# EAGLE design lcd_new (EAGLE 8.1.1)
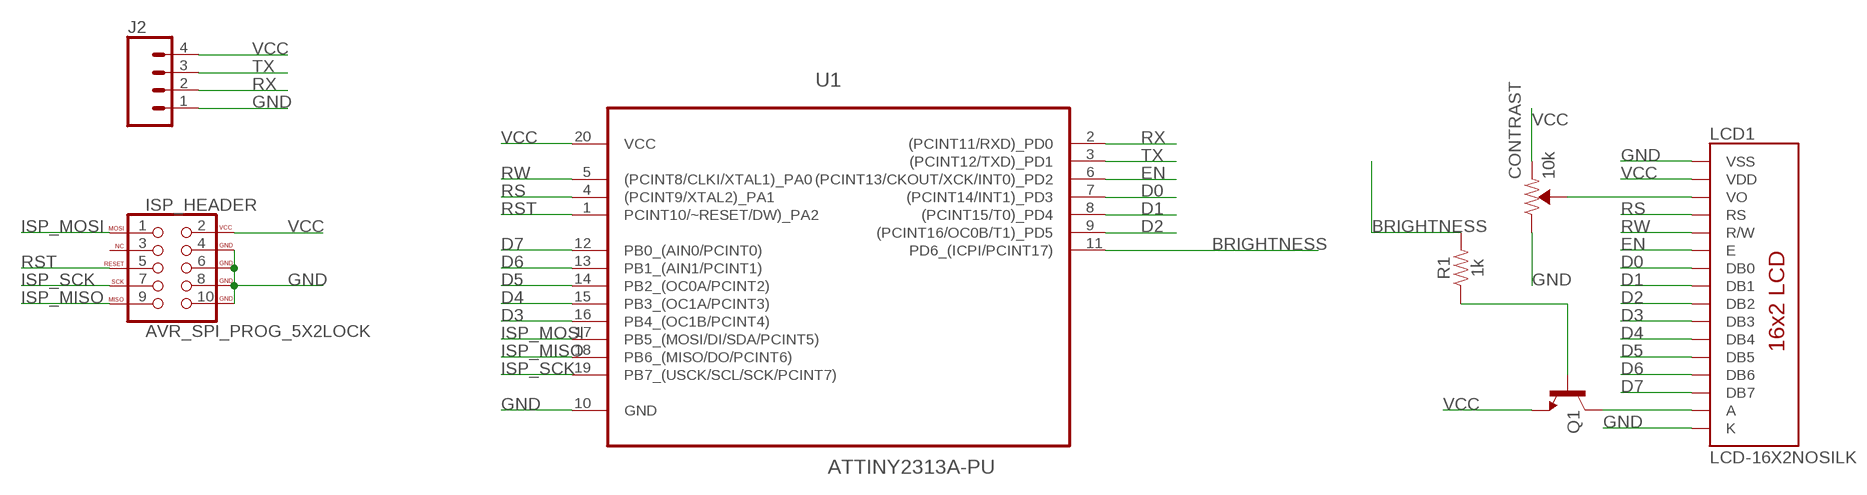
[diagram p0: schematic, sheet 1]

## Parts
CONTRAST  10k  TRIMPOT-SMD-5MM-CLOSED-1/4W-20%  [TRIMPOT-SMD-5MM]
ISP_HEADER  AVR_SPI_PROG_5X2LOCK  [2X5-SHROUDED_LOCK]
J2  CONN_04  [1X04]
LCD1  LCD-16X2NOSILK  [LCD-16X2_NOSILK]
Q1  TRANS_NPN-2N3904  [TO-92]
R1  1k  1KOHM-HORIZ-1/4W-5%  [AXIAL-0.3]
U1  ATTINY2313A-PU  [DIP254P762X533-20]

## Nets
BRIGHTNESS: R1.P$2 U1.11(PD6_(ICPI/PCINT17))
CONTRAST: CONTRAST.B(WIPER) LCD1.3(VO)
D0: LCD1.7(DB0) U1.7((PCINT14/INT1)_PD3)
D1: LCD1.8(DB1) U1.8((PCINT15/T0)_PD4)
D2: LCD1.9(DB2) U1.9((PCINT16/OC0B/T1)_PD5)
D3: LCD1.10(DB3) U1.16(PB4_(OC1B/PCINT4))
D4: LCD1.11(DB4) U1.15(PB3_(OC1A/PCINT3))
D5: LCD1.12(DB5) U1.14(PB2_(OC0A/PCINT2))
D6: LCD1.13(DB6) U1.13(PB1_(AIN1/PCINT1))
D7: LCD1.14(DB7) U1.12(PB0_(AIN0/PCINT0))
EN: LCD1.6(E) U1.6((PCINT13/CKOUT/XCK/INT0)_PD2)
GND: CONTRAST.C(CW) ISP_HEADER.4(GND) ISP_HEADER.6(GND) ISP_HEADER.8(GND) ISP_HEADER.10(GND) J2.1 LCD1.1(VSS) LCD1.16(K) U1.10(GND)
ISP_MISO: ISP_HEADER.9(MISO) U1.18(PB6_(MISO/DO/PCINT6))
ISP_MOSI: ISP_HEADER.1(MOSI) U1.17(PB5_(MOSI/DI/SDA/PCINT5))
ISP_SCK: ISP_HEADER.7(SCK) U1.19(PB7_(USCK/SCL/SCK/PCINT7))
N$1: LCD1.15(A) Q1.3(C)
N$2: Q1.2(B) R1.P$1
RS: LCD1.4(RS) U1.4((PCINT9/XTAL2)_PA1)
RST: ISP_HEADER.5(RESET) U1.1(PCINT10/~RESET/DW)_PA2)
RW: LCD1.5(R/W) U1.5((PCINT8/CLKI/XTAL1)_PA0)
RX: J2.2 U1.2((PCINT11/RXD)_PD0)
TX: J2.3 U1.3((PCINT12/TXD)_PD1)
VCC: CONTRAST.A(CCW) ISP_HEADER.2(VCC) J2.4 LCD1.2(VDD) Q1.1(E) U1.20(VCC)
Unconnected: ISP_HEADER.3(NC)

## Library data of the parts
CONTRAST = SparkFun-Resistors:TRIMPOT: Trimming Potentiometer (Trimpot) Three-terminal potentiometers, with an adjustable wiper and two adjustable resistors. A pot can be used to create a configurable voltage divider, or as a variable resistor. "Trimpots" are a subset of potentiometers, usually intended for "set-and-forget" applications. They're often more delicate than standard potentiometers - rated for fewer turns. Variants PTH-KNOB - PTH Trimpot w/ finger-adjustable knob Trimpot 10K with Knob <https://www.sparkfun.com/products/9806> (COM-09806) Datasheet <http://www.sparkfun.com/datasheets/Components/General/TSR-3386.pdf> SMD-3MM-CLOSED-FRAME - SMD 3mm Square Closed-Frame Trimpot Used on e.g. EasyDriver - Stepper Motor Driver <https://www.sparkfun.com/products/12779> Datasheet <http://www.bitechnologies.com/pdfs/22.pdf> (22AR10KTR) SMD-5MM - SMD 5mm Square Closed-Frame Trimpot Used on e.g. IOIO-OTG - V2.2 <https://www.sparkfun.com/products/13613> Datasheet <http://www.vishay.com/docs/51008/ts53.pdf> (TS53YL502MR10) SMD-3MM-1/10W-25% - 3mm Square Open-Frame Trimpot Used on e.g. SparkFun Shapeoko <https://www.sparkfun.com/products/13899> Datasheet <http://www.bourns.com/docs/Product-Datasheets/TC33.pdf> (TC33X-2-103E); PROD_ID: RES-11156; VALUE: 5k
ISP_HEADER = SparkFun-Connectors:AVR_SPI_PROG_5X2: AVR 10-pin ICSP Header This is the standard AVR In Circuit Serial Programming header. Minimal, but includes pin one indicator. Works with standard Olimex programmers. SparkFun Products: 2x5 AVR ICSP Male Header <https://www.sparkfun.com/products/778> - PTH 2x5 Pin Shrouded Header <https://www.sparkfun.com/products/8506> - PTH2; PROD_ID: CONN-08671; SF_ID: PRT-08506
J2 = SparkFun-Connectors:CONN_04: Multi connection point. Often used as Generic Header-pin footprint for 0.1 inch spaced/style header connections On any of the 0.1 inch spaced packages, you can populate with these: Break Away Headers - Straight <https://www.sparkfun.com/products/116> (PRT-00116) Break Away Male Headers - Right Angle <https://www.sparkfun.com/products/553> (PRT-00553) Female Headers <https://www.sparkfun.com/products/115> (PRT-00115) Break Away Headers - Machine Pin <https://www.sparkfun.com/products/117> (PRT-00117) Break Away Female Headers - Swiss Machine Pin <https://www.sparkfun.com/products/743> (PRT-00743) For SCREWTERMINALS and SPRING TERMINALS visit here: Screw Terimnals on SparkFun.com <https://www.sparkfun.com/search/results?term=Screw+Terminals> (5mm/3.5mm/2.54mm spacing) This device is also useful as a general connection point to wire up your design to another part of your project. Our various solder wires solder well into these plated through hole pads. Hook-Up Wire - Assortment (Stranded, 22 AWG) <https://www.sparkfun.com/products/11375> (PRT-11375) Hook-Up Wire - Assortment (Solid Core, 22 AWG) <https://www.sparkfun.com/products/11367> (PRT-11367) View the entire wire category on our website here <https://www.sparkfun.com/categories/141> Special notes: Molex polarized connector foot print use with SKU : PRT-08231 with associated crimp pins and housings. 1MM SMD Version SKU: PRT-10208; PROD_ID: CONN-09696
LCD1 = SparkFun-Displays:LCD-16X2: Standard text-only 16x2 parallel input LCD Basic 16 character by 2 line display. Typically utilizes the extremely common HD44780 parallel interface chipset SparkFun Products: Basic 16x2 Green <https://www.sparkfun.com/products/255> Basic 8x2 Green <https://www.sparkfun.com/products/11122>; SF_ID: LCD-00255
Q1 = SparkFun-DiscreteSemi:TRANS_NPN: NPN transistor Current controlled devices typically used to amplify current or used as a switch. BC547 - COM-08928 <http://www.sparkfun.com/products/8928> (TO-92 45V 100mA) (1.Collector 2.Base 3.Emitter) 2N3904 - COM-00521 <http://www.sparkfun.com/products/521> (TO-92 40V 200mA) (1.Emitter 2.Base 3.Collector) P2N2222A - COM-12852 <http://www.sparkfun.com/products/12852> (TO-92 40V 600mA) (1.Collector 2.Base 3.Emitter); PROD_ID: TRANS-08447; VALUE: 200mA/40V
R1 = SparkFun-Resistors:1KOHM: 1kΩ resistor A resistor is a passive two-terminal electrical component that implements electrical resistance as a circuit element. Resistors act to reduce current flow, and, at the same time, act to lower voltage levels within circuits. - Wikipedia; PROD_ID: RES-08380
U1 = Atmel_By_element14_Batch_1-00:ATTINY2313A-PU: 8-bit Microcontroller; DESCRIPTION: 8-bit Microcontroller; MPN: ATTINY2313A-PU; OC_FARNELL: 1841616; OC_NEWARK: 12T1333; PACKAGE: DIP-20; SUPPLIER: Atmel

## Board
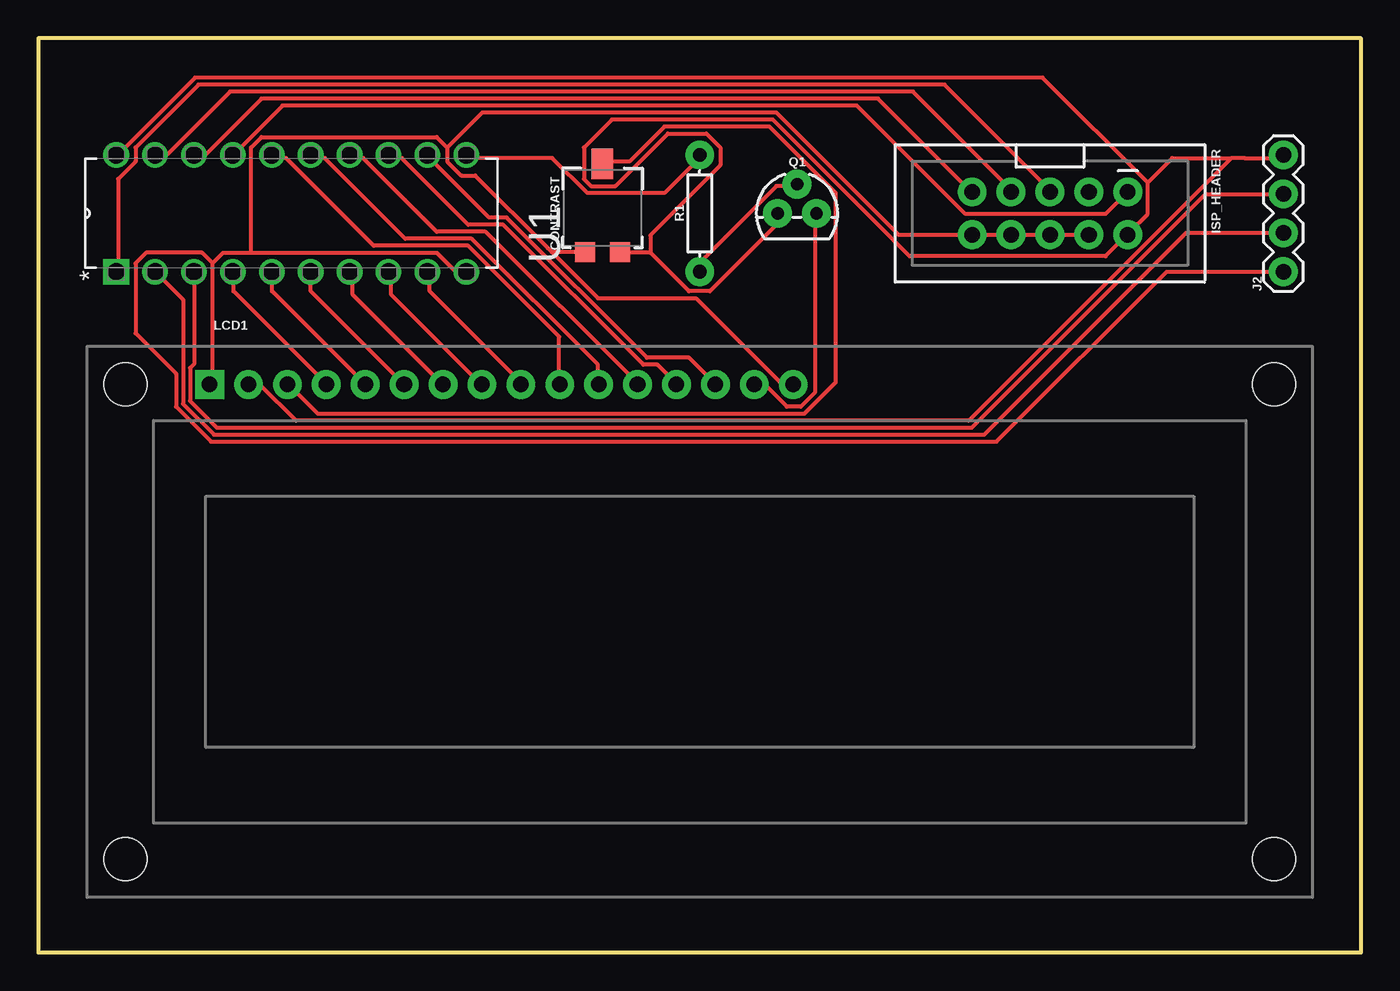
[diagram p1: board, top side]
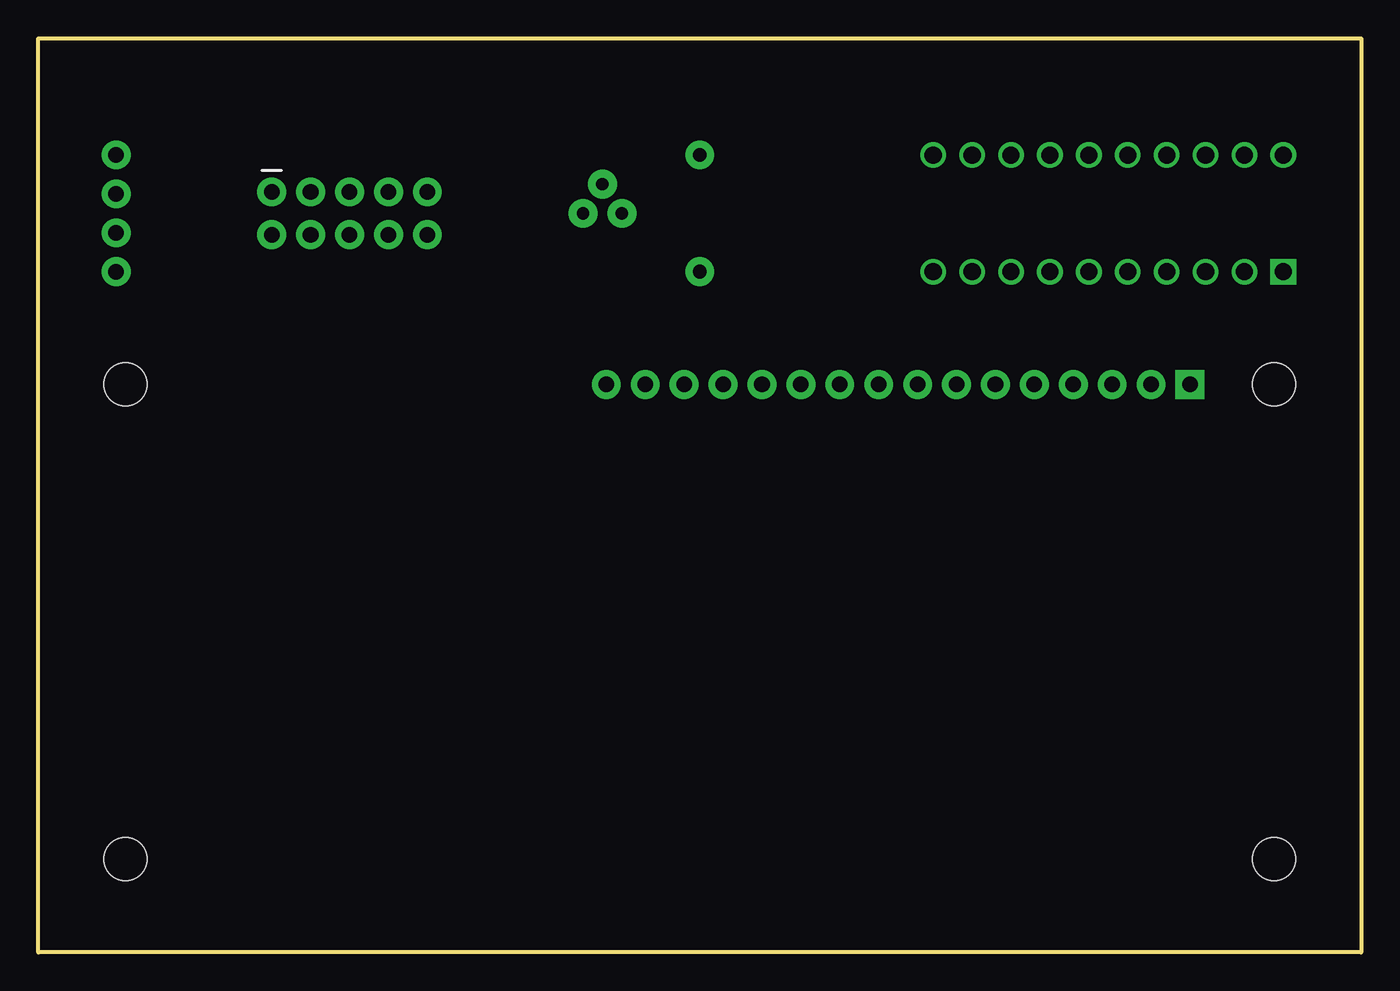
[diagram p2: board, bottom side, seen from below]

Size 86.36 x 59.69 mm. Coordinates in mm from the lower left corner, seen from the top.
Outline: 0,59.69 0,0 86.36,0 86.36,59.69 0,59.69
Copper layers (1*16): Top 0.035mm / dielectric 1.5mm / Bottom 0.035mm
Design rules "default": minimum track width 10mil, minimum drill 24mil, track to track 8mil, track to pad 8mil, pad to pad 8mil, via to via 8mil, smd to smd 8mil, copper to edge 40mil, drill to drill 8mil, minimum pad ring 10mil, minimum via ring 8mil, stop-mask expansion 4mil, vias tented up to drill 0mil, thermal gap 10mil

### Footprints (pad centres in the part's own frame; a part is rotated, then mirrored left to right if it is on the bottom)
TRIMPOT-SMD-5MM = smd 1.3 x 1.3: A 1.15,-2.54; C -1.15,-2.54 | smd 1.402 x 2: B 0,3.239
2X5-SHROUDED_LOCK = drill 1.016 pad 1.88: 1 -1.397,5.08; 2 1.397,5.08; 3 -1.397,2.54; 4 1.397,2.54; 5 -1.397,0; 6 1.397,0; 7 -1.397,-2.54; 8 1.397,-2.54; 9 -1.397,-5.08; 10 1.397,-5.08
1X04 = drill 1.016 pad 1.88: 1 0,0; 2 2.54,0; 3 5.08,0; 4 7.62,0
LCD-16X2_NOSILK = drill 1.016 pad 1.88 square: 1 -32,15.5 | drill 1.016 pad 1.88: 2 -29.46,15.5; 3 -26.92,15.5; 4 -24.38,15.5; 5 -21.84,15.5; 6 -19.3,15.5; 7 -16.76,15.5; 8 -14.22,15.5; 9 -11.68,15.5; 10 -9.14,15.5; 11 -6.6,15.5; 12 -4.06,15.5; 13 -1.52,15.5; 14 1.02,15.5; 15 3.56,15.5; 16 6.1,15.5 | hole 2.8: -37.5,15.5; -37.5,-15.5; 37.5,15.5; 37.5,-15.5
TO-92 = drill 0.813 pad 1.88: 1 -1.27,0; 2 0,1.905; 3 1.27,0
AXIAL-0.3 = drill 0.9 pad 1.88: P$1 -3.81,0; P$2 3.81,0
DIP254P762X533-20 = drill 1.118 square: 1 -7.62,22.86 | drill 1.118: 2 -7.62,20.32; 3 -7.62,17.78; 4 -7.62,15.24; 5 -7.62,12.7; 6 -7.62,10.16; 7 -7.62,7.62; 8 -7.62,5.08; 9 -7.62,2.54; 10 -7.62,0; 11 0,0; 12 0,2.54; 13 0,5.08; 14 0,7.62; 15 0,10.16; 16 0,12.7; 17 0,15.24; 18 0,17.78; 19 0,20.32; 20 0,22.86

### Placement (x,y rotation side)
CONTRAST  36.83,48.26 0 top
ISP_HEADER  66.04,48.26 270 top
J2  81.28,44.45 90 top
LCD1  43.18,21.59 0 top
Q1  49.53,48.26 0 top
R1  43.18,48.26 90 top
U1  27.94,52.07 90 top

### Tracks (layer width: path | path; a pad name or v marks a point on that pad's centre or on a via)
BRIGHTNESS
  Top 0.254: U1.11 28.07,51.87 33.55,51.87 35.84,49.58 40.87,49.58 43.16,51.87 R1.P$2
CONTRAST
  Top 0.254: CONTRAST.B 36.98,51.64 38.58,51.64 40.87,53.92 47.73,53.92 52.07,49.58 52.07,37.24 50.01,35.18 18.24,35.18 16.41,37.01 LCD1.3
D0
  Top 0.254: U1.7 20.52,44.32 20.52,42.95 26.24,37.24 LCD1.7
D1
  Top 0.254: U1.8 23.04,44.32 23.04,42.95 28.75,37.24 LCD1.8
D2
  Top 0.254: U1.9 25.55,44.32 25.55,43.18 31.5,37.24 LCD1.9
D3
  Top 0.254: U1.16 15.27,51.87 16.18,51.87 21.9,46.15 28.07,46.15 34.01,40.21 34.01,37.24 LCD1.10
D4
  Top 0.254: U1.15 17.78,51.87 18.69,51.87 23.95,46.61 28.3,46.61 36.52,38.38 36.52,37.24 LCD1.11
D5
  Top 0.254: U1.14 20.52,51.87 21.21,51.87 26.01,47.07 29.21,47.07 39.04,37.24 LCD1.12
D6
  Top 0.254: U1.13 23.04,51.87 23.72,51.87 28.07,47.52 30.35,47.52 39.5,38.38 40.41,38.38 41.55,37.24 LCD1.13
D7
  Top 0.254: U1.12 25.55,51.87 29.44,47.98 30.58,47.98 39.73,38.84 42.47,38.84 44.07,37.24 LCD1.14
EN
  Top 0.254: U1.6 17.78,43.18 23.72,37.24 LCD1.6
GND
  Top 0.254: 13.89,45.7 12.07,45.7 11.38,45.01 | 13.89,45.7 26.01,45.7 27.15,44.55 27.84,44.55 U1.10 | 11.38,45.01 11.38,37.24 LCD1.1 | 33.53,45.72 36.52,42.72 42.93,42.72 48.41,37.24 49.1,37.24 LCD1.16 | 26.7,52.55 26.7,51.64 27.61,50.72 28.52,50.72 33.27,45.97 33.53,45.72 | 26.7,52.55 26.01,53.24 14.58,53.24 13.89,52.55 13.89,45.7 | 11.38,45.01 10.69,45.7 7.04,45.7 6.35,45.01 6.35,40.44 9,37.79 9,35.64 11.28,33.35 62.56,33.35 73.66,44.45 J2.1 81.1,44.32 | 26.7,52.55 28.98,54.84 48.18,54.84 56.16,46.86 ISP_HEADER.10 ISP_HEADER.8 ISP_HEADER.6 ISP_HEADER.4 | CONTRAST.C 33.53,45.72
ISP_MISO
  Top 0.254: U1.18 10.24,52.09 10.92,52.09 14.58,55.75 54.81,55.75 60.76,49.81 ISP_HEADER.9
ISP_MOSI
  Top 0.254: ISP_HEADER.1 69.67,48.21 60.53,48.21 53.44,55.3 15.95,55.3 12.75,52.09 U1.17
ISP_SCK
  Top 0.254: U1.19 7.72,52.09 8.41,52.09 12.52,56.21 57.1,56.21 63.5,49.81 ISP_HEADER.7
N$1
  Top 0.254: LCD1.15 46.81,37.01 47.5,37.01 48.87,35.64 49.78,35.64 50.7,36.55 50.7,48.21 Q1.3
N$2
  Top 0.254: R1.P$1 43.38,44.55 43.38,45.24 48.18,50.04 49.33,50.04 Q1.2
RS
  Top 0.254: U1.4 12.75,44.32 12.75,43.18 18.69,37.24 LCD1.4
RST
  Top 0.254: U1.1 5.21,44.55 5.21,50.5 6.35,51.64 6.35,52.55 10.47,56.67 59.16,56.67 66.02,49.81 ISP_HEADER.5
RW
  Top 0.254: U1.5 15.27,44.32 15.27,43.18 21.21,37.24 LCD1.5
RX
  Top 0.254: 7.72,44.32 U1.2 9.45,42.62 9.45,35.82 11.47,33.81 61.75,33.81 74.93,46.99 J2.2
TX
  Top 0.254: 81.1,49.35 J2.3 76.2,49.53 60.94,34.27 11.66,34.27 9.91,36.01 9.91,38.17 10.16,38.42 U1.3
VCC
  Top 0.254: 39.95,45.7 38.13,45.7 CONTRAST.A | 39.95,45.7 42.47,43.18 43.84,43.18 48.18,47.52 48.18,48.21 Q1.1 | 72.41,50.27 65.56,57.12 10.24,57.12 5.21,52.09 U1.20 | 72.41,50.27 72.41,48.21 71.27,47.07 ISP_HEADER.2 71.04,46.84 69.67,45.47 56.87,45.47 47.96,54.38 37.44,54.38 35.61,52.55 35.61,50.5 36.07,50.04 37.67,50.04 41.1,53.47 43.61,53.47 44.53,52.55 44.53,51.41 39.95,46.84 39.95,45.7 | 77.89,51.87 74.02,51.87 72.41,50.27 | J2.4 81.1,51.87 78.74,51.87 77.89,51.87 | LCD1.2 14.46,37.09 16.83,34.72 60.74,34.72 77.89,51.87